# Altium schematic sheet SDM30.SchDoc
size A4; SheetNumber: 1; SheetTotal: 1
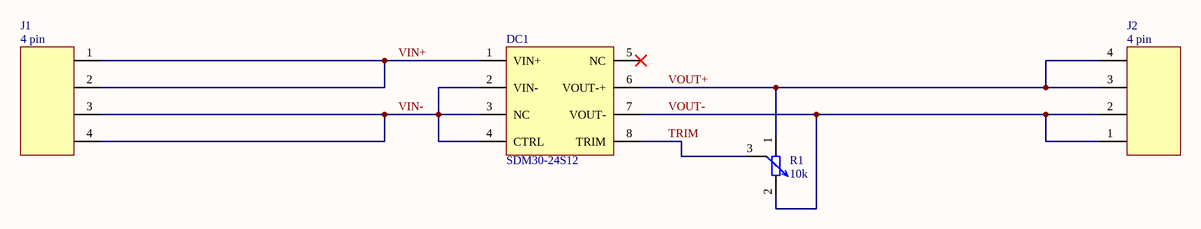
[diagram p0: SDM30.SchDoc]

## Parts
DC1  SDM30-24S12  [SDM30-24S12]
J1  4 pin  [4 pin terminal 5 mm]
J2  4 pin  [4 pin terminal 5 mm]
R1  10k  [3 pin header]

## Nets
TRIM: DC1.8(TRIM) R1.3
VIN+: DC1.1(VIN+) J1.1 J1.2
VIN-: DC1.2(VIN-) DC1.3(NC) DC1.4(CTRL) J1.3 J1.4
VOUT+: DC1.6(VOUT-+) J2.3 J2.4 R1.1
VOUT-: DC1.7(VOUT-) J2.1 J2.2 R1.2

Not connected (* = marked no-connect by the designer): DC1 5(NC)*

## Library data of the parts
DC1 = SDM30-24S12: Isolated DC/DC Converters - Through Hole 30W 24Vin 12Vout 2.5A; Manufacturer: Mean Well; Part Number: SDM30-24S12; Value: SDM30-24S12; Supplier: *; Order Code: *
J1 J2 = TERMINAL_BLOCK_5mm_4pin: Part Number: *; Value: 4 pin; Manufacturer: *; Supplier: *; Order Code: *
R1 = RES_POT_THT_generic: Part Number: *; Value: 10k; Manufacturer: *; Supplier: *; Order Code: *